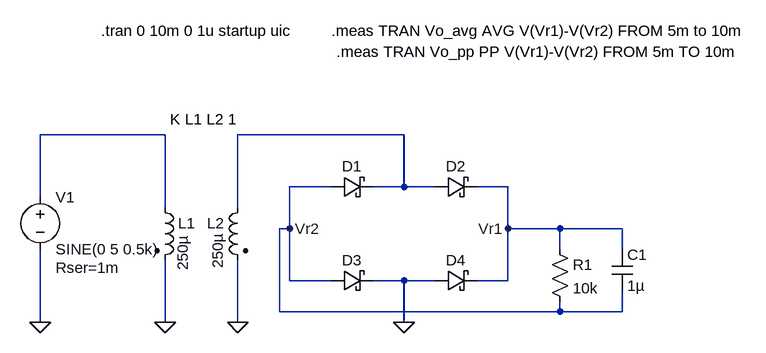
[diagram p0: schematic classical_rectifier.asc]
classical_rectifier.asc, the LTspice schematic file:
Version 4
SHEET 1 880 680
WIRE -176 0 -368 0
WIRE 192 0 -64 0
WIRE 80 80 16 80
WIRE 192 80 192 0
WIRE 192 80 144 80
WIRE 240 80 192 80
WIRE 352 80 304 80
WIRE -368 96 -368 0
WIRE -176 112 -176 0
WIRE -64 112 -64 0
WIRE 16 144 16 80
WIRE 16 144 0 144
WIRE 352 144 352 80
WIRE 432 144 352 144
WIRE 528 144 432 144
WIRE 432 176 432 144
WIRE 528 176 528 144
WIRE 16 224 16 144
WIRE 80 224 16 224
WIRE 192 224 144 224
WIRE 240 224 192 224
WIRE 352 224 352 144
WIRE 352 224 304 224
WIRE 0 272 0 144
WIRE 432 272 432 256
WIRE 432 272 0 272
WIRE 528 272 528 240
WIRE 528 272 432 272
WIRE -368 288 -368 176
WIRE -176 288 -176 192
WIRE -64 288 -64 192
WIRE 192 288 192 224
FLAG -64 288 0
FLAG 192 288 0
FLAG -368 288 0
FLAG -176 288 0
FLAG 352 144 Vr1
FLAG 16 144 Vr2
SYMBOL schottky 80 96 R270
WINDOW 0 32 32 VTop 2
WINDOW 3 0 32 Invisible 2
SYMATTR InstName D1
SYMATTR Value RSX051VA-30
SYMATTR Description Diode
SYMATTR Type diode
SYMBOL ind2 -192 96 R0
WINDOW 3 43 112 VLeft 2
SYMATTR Value 250µ
SYMATTR InstName L1
SYMATTR Type ind
SYMBOL ind2 -48 96 M0
WINDOW 3 47 55 VRight 2
SYMATTR Value 250µ
SYMATTR InstName L2
SYMATTR Type ind
SYMBOL schottky 240 96 R270
WINDOW 0 32 32 VTop 2
WINDOW 3 0 32 Invisible 2
SYMATTR InstName D2
SYMATTR Value RSX051VA-30
SYMATTR Description Diode
SYMATTR Type diode
SYMBOL schottky 80 240 R270
WINDOW 0 32 32 VTop 2
WINDOW 3 0 32 Invisible 2
SYMATTR InstName D3
SYMATTR Value RSX051VA-30
SYMATTR Description Diode
SYMATTR Type diode
SYMBOL schottky 240 240 R270
WINDOW 0 32 32 VTop 2
WINDOW 3 0 32 Invisible 2
SYMATTR InstName D4
SYMATTR Value RSX051VA-30
SYMATTR Description Diode
SYMATTR Type diode
SYMBOL voltage -368 80 R0
WINDOW 123 0 0 Left 0
WINDOW 39 24 124 Left 2
SYMATTR SpiceLine Rser=1m
SYMATTR InstName V1
SYMATTR Value SINE(0 5 0.5k)
SYMBOL res 416 160 R0
SYMATTR InstName R1
SYMATTR Value 10k
SYMBOL cap 512 176 R0
SYMATTR InstName C1
SYMATTR Value 1µ
TEXT -168 -24 Left 2 !K L1 L2 1
TEXT -274 -160 Left 2 !.tran 0 10m 0 1u startup uic
TEXT 80 -160 Left 2 !.meas TRAN Vo_avg AVG V(Vr1)-V(Vr2) FROM 5m to 10m
TEXT 88 -128 Left 2 !.meas TRAN Vo_pp PP V(Vr1)-V(Vr2) FROM 5m TO 10m

The netlist it stands for:
* classical_rectifier.asc
D1 Vr2 N002 RSX051VA-30
L1 N001 0 250µ
L2 N002 0 250µ
D2 N002 Vr1 RSX051VA-30
D3 Vr2 0 RSX051VA-30
D4 0 Vr1 RSX051VA-30
V1 N001 0 SINE(0 5 0.5k) Rser=1m
R1 Vr1 Vr2 10k
C1 Vr1 Vr2 1µ
.model D D
.lib standard.dio
K L1 L2 1
.tran 0 10m 0 1u startup uic
.meas TRAN Vo_avg AVG V(Vr1)-V(Vr2) FROM 5m to 10m
.meas TRAN Vo_pp PP V(Vr1)-V(Vr2) FROM 5m TO 10m
.backanno
.end